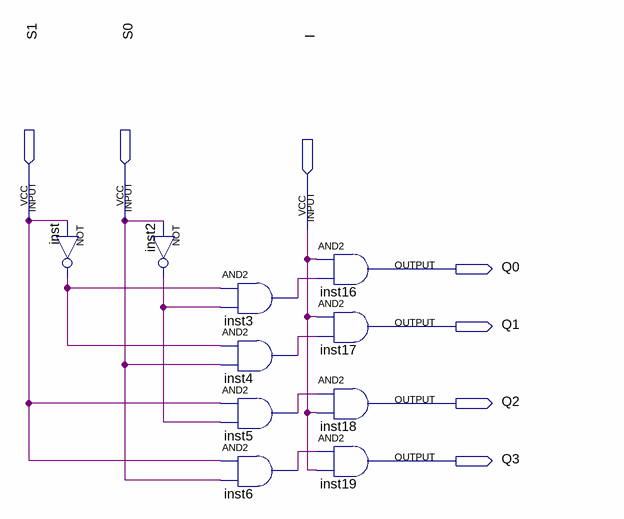
[diagram p0: schematic sheet]
// Quartus schematic s1111408_lab02_4.bdf as structural Verilog: 10 symbols, 7 pins
module s1111408_lab02_4 (
  input  S1,
  input  S0,
  input  I,
  output Q0,
  output Q1,
  output Q2,
  output Q3
);

  wire inst2_out, inst3_out, inst4_out, inst5_out, inst6_out, inst_out;

  not inst (inst_out, S1);
  not inst2 (inst2_out, S0);
  and inst3 (inst3_out, inst_out, inst2_out);
  and inst4 (inst4_out, inst_out, S0);
  and inst5 (inst5_out, S1, inst2_out);
  and inst6 (inst6_out, S1, S0);
  and inst16 (Q0, I, inst3_out);
  and inst17 (Q1, I, inst4_out);
  and inst18 (Q2, inst5_out, I);
  and inst19 (Q3, inst6_out, I);
endmodule
